# Altium schematic sheet 12V_to_5V.SchDoc
size A4; SheetNumber: 8; SheetTotal: 8
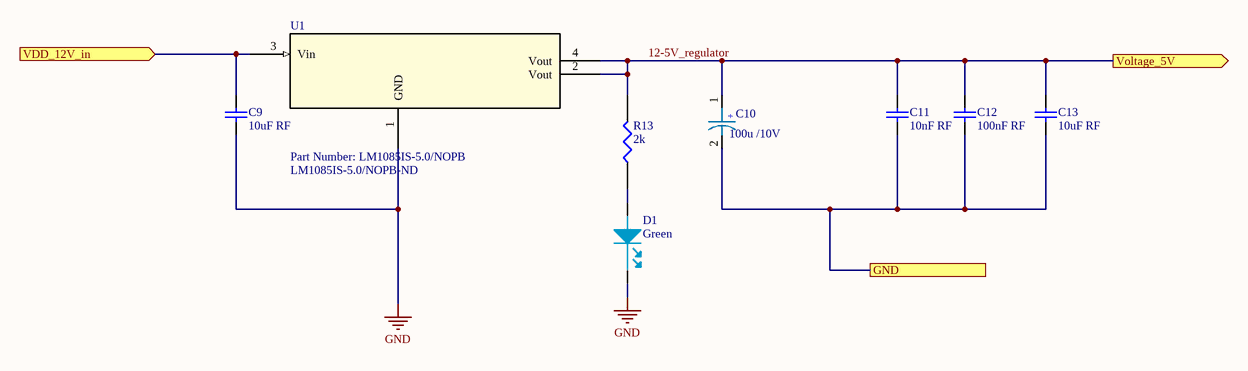
[diagram p0: 12V_to_5V.SchDoc]

## Parts
C9  10uF RF  [C0805]
C10  100u /10V  [C_ALU_C_SIZE]
C11  10nF RF  [C0805]
C12  100nF RF  [C0805]
C13  10uF RF  [C0805]
D1  Green  [LED_0603]
R13  2k  [R0805]
U1  Part Number: LM1085IS-5.0/NOPB  Supplier Part Number 1: LM1085IS-5.0/NOPB-ND  [LM1085]

## Ports
GND, VDD_12V_in (in), Voltage_5V (out)

## Nets
GND: C9.2 D1.1(Cathode) U1.1(GND)
12-5V_regulator: C10.1 C11.1 C12.1 C13.1 R13.2 U1.2(Vout) U1.4(Vout) ; port Voltage_5V
GND: C10.2 C11.2 C12.2 C13.2 ; port GND  [a separate net that carries the same name]
VDD_12V_in: C9.1 U1.3(Vin) ; port VDD_12V_in
NetD1_2: D1.2(Anode) R13.1

## Notes on the sheet
- (in symbol CAP-10uF) +

## Library data of the parts
C9 C11-C13 = UMK212SD103KD-T: CAP 10nF 50V RF; Manufacturer: Taiyo Yuden; Dielectric Material: Ceramic; Tolerance: 10%; Supplier 1: Digi-Key; Manufacturer Part Number: UMK212SD103KD-T; Stock 1: 14125; Pricing 1: 1=0.47, 10=0.323, 100=0.1941, 500=0.1455, 1000=0.1229 (USD); Mount: Surface Mount; Case/Package: 0805; Number of Pins: 2; Case Code (Metric): 2012; Case Code (Imperial): 0805; Min Operating Temperature: -55°C; Max Operating Temperature: 125°C; Capacitance: 10nF; Packaging: Tape and Reel; Package Quantity: 1; Voltage Rating: 50V; Voltage Rating (DC): 50V; Termination: SMD/SMT; Length: 2mm; Height: 0.85mm; Width: 0.049inch; Thickness: 0.037inch; Depth: 1.25mm; Radiation Hardening: No; Lead Free: Lead Free; Halogen Free: Halogen Free; ComponentLink1URL: https://datasheet.ciiva.com/138/umk212sd103kd-t-ss-138661.pdf; ComponentLink1Description: https://datasheet.ciiva.com/138/umk212sd103kd-t-ss-138661.pdf; ComponentLink2URL: https://datasheet.ciiva.com/138/mlcc07-e-138662.pdf; ComponentLink2Description: https://datasheet.ciiva.com/138/mlcc07-e-138662.pdf; ComponentLink3URL: https://datasheet.ciiva.com/138/mlcc07-e-138663.pdf; ComponentLink3Description: https://datasheet.ciiva.com/138/mlcc07-e-138663.pdf; ComponentLink4URL: https://datasheet.ciiva.com/30140/303umk212sd103kd-t-30140925.pdf; ComponentLink4Description: https://datasheet.ciiva.com/30140/303umk212sd103kd-t-30140925.pdf; Supplier Part Number 1: 587-1114-1-ND
C10 = CAP-10uF: CAP ALUM 100UF 20% 10V SMD; Manufacturer: Panasonic Electronic Components; Manufacturer Part Number: EEE-1AA101WR; Lifetime @ Temp.: 1000 Hrs @ 85°C; Polarization: Polar; Surface Mount Land Size: 0.209" L x 0.209" W (5.30mm x 5.30mm); Supplier 1: Digi-Key; RoHS: RoHS Compliant; Category: Capacitors; Stock 1: 89696; Pricing 1: 1=0.31, 10=0.212, 100=0.1272, 500=0.09538 (USD); Packaging: Cut Tape (CT); Part Status: Active; Tolerance: ±20%; ESR (Equivalent Series Resistance): -; Operating Temperature: -40°C ~ 85°C; Ratings: AEC-Q200; Applications: Automotive; Lead Spacing: -; Size / Dimension: 0.197" Dia (5.00mm); Height - Seated (Max): 0.213" (5.40mm); Mounting Type: Surface Mount; Package / Case: Radial, Can - SMD; ComponentLink1URL: https://industrial.panasonic.com/cdbs/www-data/pdf/RDE0000/ABA0000C1145.pdf; ComponentLink1Description: https://industrial.panasonic.com/cdbs/www-data/pdf/RDE0000/ABA0000C1145.pdf; Supplier Part Number 1: PCE3867CT-ND
D1 = LG L29K-G2J1-24-Z: LED GREEN DIFFUSED 0603 SMD; Manufacturer: OSRAM Opto Semiconductors Inc.; Lens Color: White; Millicandela Rating: 3.92mcd; Lens Style/Size: Rectangle with Flat Top, 1.30mm x 0.80mm; Voltage - Forward (Vf) (Typ): 1.7V; Current - Test: 2mA; Viewing Angle: 160°; Wavelength - Dominant: 570nm; Wavelength - Peak: 572nm; Supplier 1: Digi-Key; Manufacturer Part Number: LG L29K-G2J1-24-Z; RoHS: RoHS Compliant; Category: Optoelectronics; Stock 1: 0; Pricing 1: 1=0.47, 10=0.339, 25=0.2768, 100=0.2215, 250=0.18688, 500=0.15918, 1000=0.12458, 2500=0.1142 (USD); Packaging: Cut Tape (CT); Part Status: Active; Color: Green; Lens Transparency: Diffused; Mounting Type: Surface Mount; Features: -; Package / Case: 0603 (1608 Metric); Supplier Device Package: 0603; Size / Dimension: 1.70mm L x 0.80mm W; Height (Max): 0.65mm; ComponentLink1URL: http://www.osram-os.com/Graphics/XPic0/00167682_0.pdf; ComponentLink1Description: http://www.osram-os.com/Graphics/XPic0/00167682_0.pdf; Supplier Part Number 1: 475-2709-1-ND
R13 = RES
U1 = LM1085-IS-5.0/NOP: No Description Available; Vendor: Texas Instruments; Built_By: EMA_UL_Team; SourceLibrary: National_2011-09-26; Manufacturer_Part_Number: LM1085IS-5.0/NOPB; Copyright: Copyright (C) 2018 Accelerated Designs. All rights reserved; RefDes: RefDes; Type: DEV; Value: Value; Supplier 1: Digi-Key